# Altium schematic sheet CH32L103C8T6-R0.SchDoc
size 304 x 254 mm
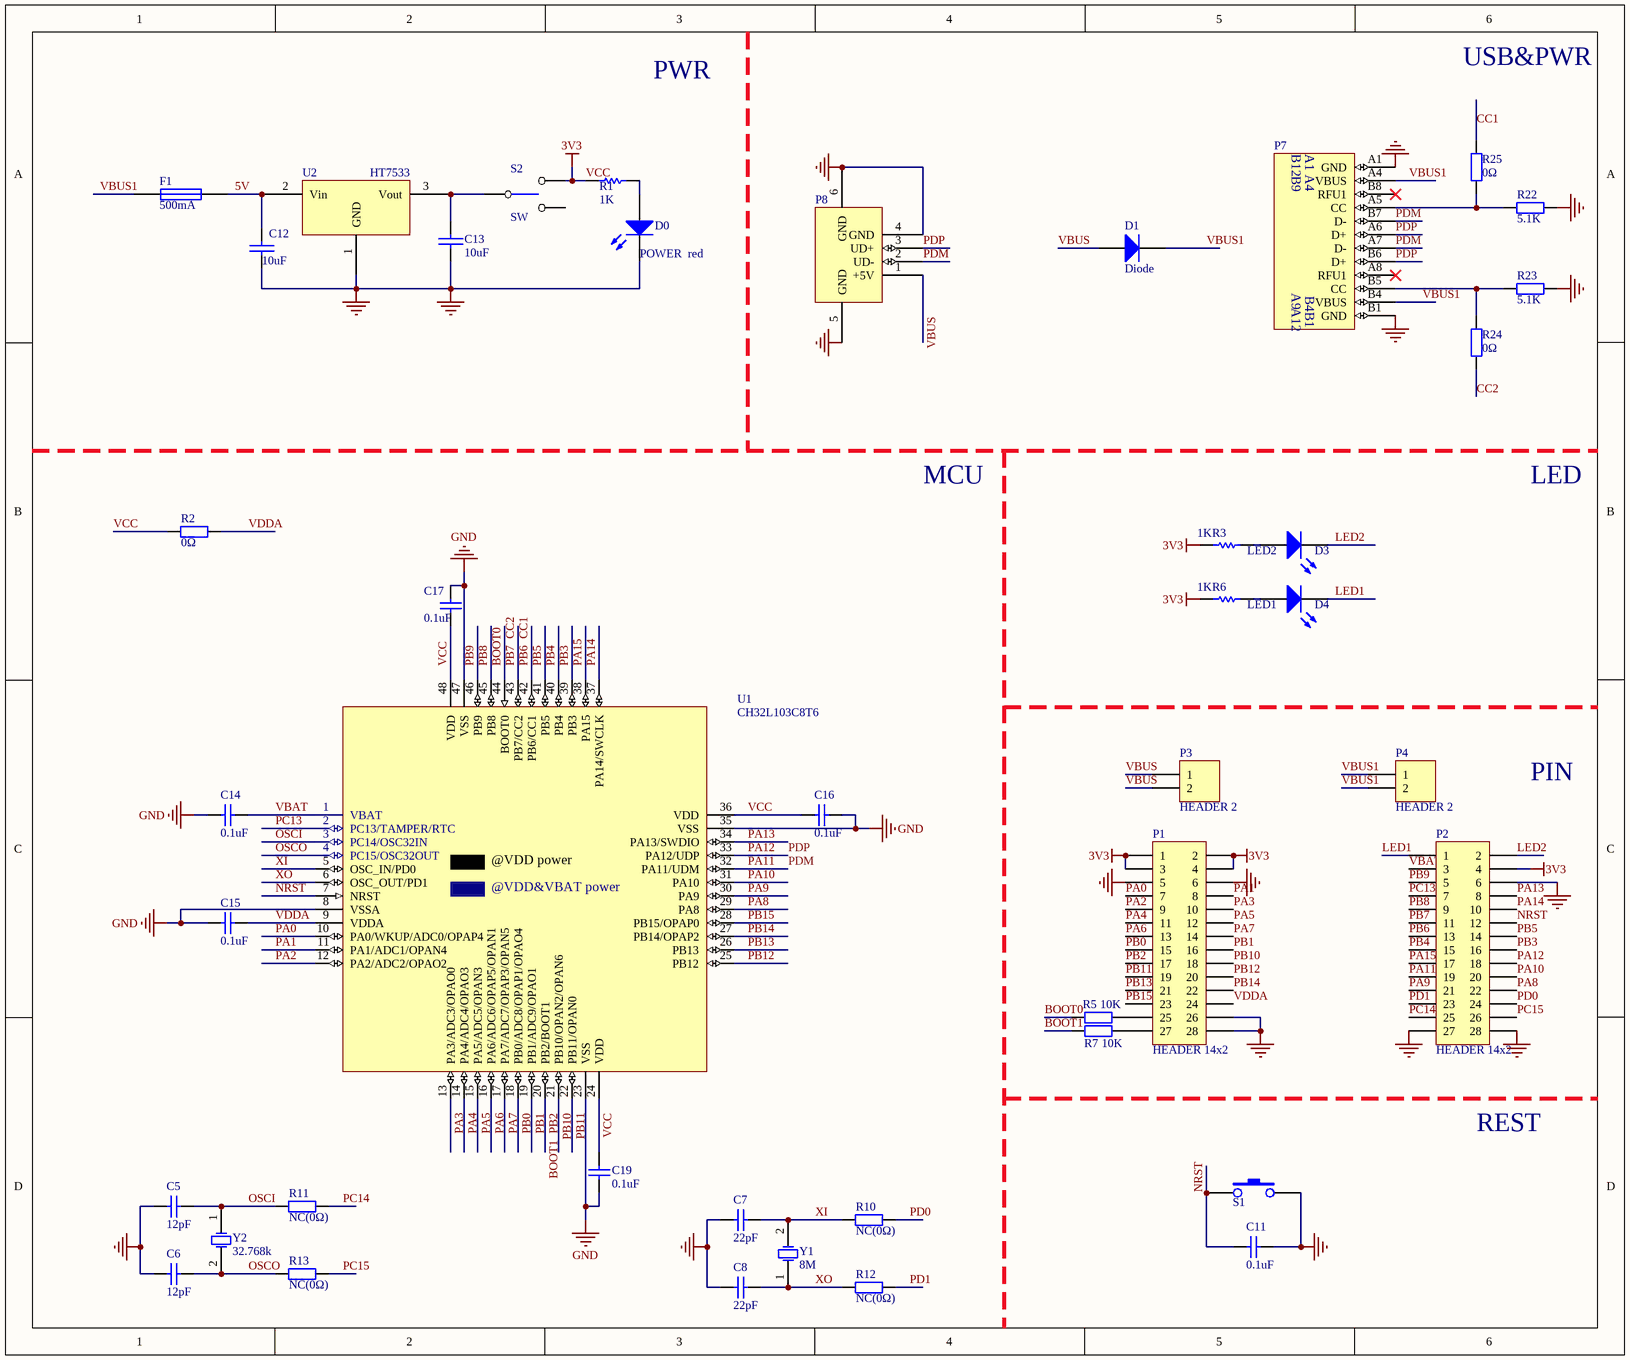
[diagram p0: CH32L103C8T6-R0.SchDoc]

## Parts
C5  12pF  [0603_C]
C6  12pF  [0603_C]
C7  22pF  [0603_C]
C8  22pF  [0603_C]
C11  0.1uF  [0603_C]
C12  10uF  [0603_C]
C13  10uF  [0603_C]
C14  0.1uF  [0603_C]
C15  0.1uF  [0603_C]
C16  0.1uF  [0603_C]
C17  0.1uF  [0603_C]
C19  0.1uF  [0603_C]
D0  POWER  red  [0603+]
D1  Diode  [SOD-123]
D3  LED2  [0603+]
D4  LED1  [0603+]
F1  500mA  [0603]
P1  HEADER 14x2  [IDC28-2.54MM]
P2  HEADER 14x2  [IDC28-2.54MM]
P3  HEADER 2  [SIP2-2.54mm]
P4  HEADER 2  [SIP2-2.54mm]
P7  TYPE-C  [TYPE-C-Receptacle-2.0]  (value not drawn)
P8  USB_A  [USBAF]  (value not drawn)
R1  1K  [0603]
R2  0Ω  [0603]
R3  1K  [0603]
R5  10K  [0603]
R6  1K  [0603]
R7  10K  [0603]
R10  NC(0Ω)  [0603]
R11  NC(0Ω)  [0603]
R12  NC(0Ω)  [0603]
R13  NC(0Ω)  [0603]
R22  5.1K  [0603]
R23  5.1K  [0603]
R24  0Ω  [0603]
R25  0Ω  [0603]
S1  KEY  [贴片按键]  (value not drawn)
S2  SW  [SW1]
U1  CH32L103C8T6  [LQFP48]
U2  HT7533  [SOT-89]
Y1  8M  [XT_AT49]
Y2  32.768k  [FC-135]

## Nets
GND: C5.2 C6.2 C7.1 C8.1 C11.1 C12.2 C13.2 C14.2 C15.2 C16.2 C17.1 C19.1 D0.2(K) P1.5 P1.6 P1.26 P1.28 P2.6 P2.27 P2.28 P7.A1(GND) P7.B1(GND) P8.4(GND) P8.5(GND) P8.6(GND) R22.2 R23.2 S1.2 U1.8(VSSA) U1.23(VSS) U1.35(VSS) U1.47(VSS) U2.1(GND)
VCC: C16.1 C17.2 C19.2 P1.1 P1.2 P1.3 P1.4 P2.4 R1.2 R2.1 R3.1 R6.1 S2.3 U1.24(VDD) U1.36(VDD) U1.48(VDD)  [also labelled 3V3]
5V: C12.1 F1.2 U2.2(Vin)
BOOT0: R5.1 U1.44(BOOT0)
BOOT1: P1.17 R7.1 U1.20(PB2/BOOT1)  [also labelled PB2]
CC1: P2.13 R25.2 U1.42(PB6/CC1)  [also labelled PB6]
CC2: P2.11 R24.1 U1.43(PB7/CC2)  [also labelled PB7]
LED1: D4.2(K) P2.1
LED2: D3.2(K) P2.2
NRST: C11.2 P2.12 S1.1 U1.7(NRST)
OSCI: C5.1 R11.2 U1.3(PC14/OSC32IN) Y2.1(OSC1)
OSCO: C6.1 R13.2 U1.4(PC15/OSC32OUT) Y2.2(OSC2)
PA0: P1.7 U1.10(PA0/WKUP/ADC0/OPAP4)
PA1: P1.8 U1.11(PA1/ADC1/OPAN4)
PA2: P1.9 U1.12(PA2/ADC2/OPAO2)
PA3: P1.10 U1.13(PA3/ADC3/OPAO0)
PA4: P1.11 U1.14(PA4/ADC4/OPAO3)
PA5: P1.12 U1.15(PA5/ADC5/OPAN3)
PA6: P1.13 U1.16(PA6/ADC6/OPAP5/OPAN1)
PA7: P1.14 U1.17(PA7/ADC7/OPAP3/OPAN5)
PA8: P2.22 U1.29(PA8)
PA9: P2.21 U1.30(PA9)
PA10: P2.20 U1.31(PA10)
PA11: P2.19 P7.A7(D-) P7.B7(D-) P8.2(UD-) U1.32(PA11/UDM)  [also labelled PDM]
PA12: P2.18 P7.A6(D+) P7.B6(D+) P8.3(UD+) U1.33(PA12/UDP)  [also labelled PDP]
PA13: P2.8 U1.34(PA13/SWDIO)
PA14: P2.10 U1.37(PA14/SWCLK)
PA15: P2.17 U1.38(PA15)
PB0: P1.15 U1.18(PB0/ADC8/OPAP1/OPAO4)
PB1: P1.16 U1.19(PB1/ADC9/OPAO1)
PB3: P2.16 U1.39(PB3)
PB4: P2.15 U1.40(PB4)
PB5: P2.14 U1.41(PB5)
PB8: P2.9 U1.45(PB8)
PB9: P2.5 U1.46(PB9)
PB10: P1.18 U1.21(PB10/OPAN2/OPAN6)
PB11: P1.19 U1.22(PB11/OPAN0)
PB12: P1.20 U1.25(PB12)
PB13: P1.21 U1.26(PB13)
PB14: P1.22 U1.27(PB14/OPAP2)
PB15: P1.23 U1.28(PB15/OPAP0)
PC13: P2.7 U1.2(PC13/TAMPER/RTC)
PC14: P2.25 R11.1
PC15: P2.26 R13.1
PD0: P2.24 R10.1
PD1: P2.23 R12.1
VBAT: C14.1 P2.3 U1.1(VBAT)
VBUS: D1.1(A) P3.1 P3.2 P8.1(+5V)
VBUS1: D1.2(K) F1.1 P4.1 P4.2 P7.A4(VBUS) P7.B4(VBUS)
VDDA: C15.1 P1.24 R2.2 U1.9(VDDA)
XI: C7.2 R10.2 U1.5(OSC_IN/PD0) Y1.2(OSC2)
XO: C8.2 R12.2 U1.6(OSC_OUT/PD1) Y1.1(OSC1)
NetC13_1: C13.1 S2.1 U2.3(Vout)
NetD0_1: D0.1(A) R1.1
NetD3_1: D3.1(A) R3.2
NetD4_1: D4.1(A) R6.2
NetP1_25: P1.25 R5.2
NetP1_27: P1.27 R7.2
NetP7_A5: P7.A5(CC) R22.1 R25.1
NetP7_B5: P7.B5(CC) R23.1 R24.2

Not connected (* = marked no-connect by the designer): P7 A8(RFU1)* B8(RFU1)*; S2 2

## Notes on the sheet
- PWR
- USB&PWR
- MCU
- LED
- PIN
- REST
- (in symbol CH32L103C8T6) @VDD power; @VDD&VBAT power
- (in symbol TYPE-C1) B12; B9; A9; A12

## Library data of the parts
C5-C8 C11 = Cap: Capacitor; Published: 8-Jun-2000; LatestRevisionDate: 17-Jul-2002; LatestRevisionNote: Re-released for DXP Platform.; PackageReference: RAD-0.3; Publisher: Altium Limited
  C11: Value: 0.1uF
C12 C13 = CAP: Capacitor
C14-C17 C19 = Cap: Capacitor; Value: 15pF; Published: 8-Jun-2000; LatestRevisionDate: 17-Jul-2002; LatestRevisionNote: Re-released for DXP Platform.; PackageReference: RAD-0.3; Publisher: Altium Limited
D0 D3 D4 = LED0: Typical INFRARED GaAs LED; Published: 8-Jun-2000; LatestRevisionDate: 08-Jul-2005; LatestRevisionNote: Mech Layer 1 removed.; PackageReference: LED-0; Publisher: Altium Limited
D1 = Diode: Default Diode; Published: 8-Jun-2000; LatestRevisionDate: 17-Jul-2002; LatestRevisionNote: Re-released for DXP Platform.; PackageVersion: Sep-1996; PackageReference: SMC; Publisher: Altium Limited; Code_JEDEC: DO-214-AB
F1 = FUSE1: Fuse
P1 P2 = HEADER 14x2: Header, 14-Pin, Dual row
P3 P4 = HEADER 2: Header, 2-Pin
P7 = TYPE-C1
P8 = USB: USB Port
R1 R3 R6 = Res Semi: Semiconductor Resistor
R2 R5 R7 R10-R13 R22-R25 = Res2: Resistor
  R5 R7: Published: 8-Jun-2000; LatestRevisionDate: 17-Jul-2002; LatestRevisionNote: Re-released for DXP Platform.; PackageReference: AXIAL-0.4; Publisher: Altium Limited; Value: 10K
U1 = CH32L103C8T6: RISC-V LMD-MCU, 96MHz, USB, Type-C/PD, CAN, OPA, lower power
U2 = 1117-3.3V
Y1 Y2 = XTAL: Crystal Oscillator; Published: 8-Jun-2000; LatestRevisionDate: 17-Jul-2002; LatestRevisionNote: Re-released for DXP Platform.; PackageReference: R38; Publisher: Altium Limited